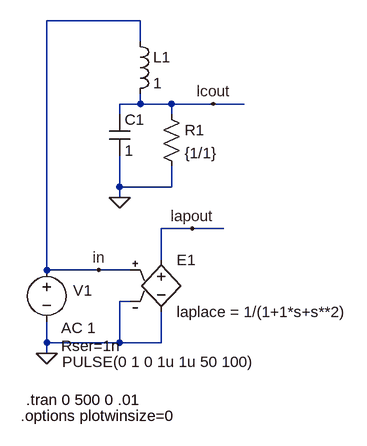
[diagram p0: schematic compare laplace and lpf q=1.asc]
compare laplace and lpf q=1.asc, the LTspice schematic file:
Version 4
SHEET 1 880 680
WIRE 224 -240 80 -240
WIRE 224 -208 224 -240
WIRE 224 -112 224 -128
WIRE 224 -112 192 -112
WIRE 272 -112 224 -112
WIRE 336 -112 272 -112
WIRE 384 -112 336 -112
WIRE 192 -96 192 -112
WIRE 272 -96 272 -112
WIRE 192 16 192 -32
WIRE 272 16 272 -16
WIRE 272 16 192 16
WIRE 192 32 192 16
WIRE 304 80 256 80
WIRE 352 80 304 80
WIRE 256 128 256 80
WIRE 80 144 80 -240
WIRE 160 144 80 144
WIRE 208 144 160 144
WIRE 208 192 192 192
WIRE 80 256 80 224
WIRE 192 256 192 192
WIRE 192 256 80 256
WIRE 256 256 256 208
WIRE 256 256 192 256
WIRE 80 272 80 256
FLAG 80 272 0
FLAG 304 80 lapout
FLAG 160 144 in
FLAG 192 32 0
FLAG 336 -112 lcout
SYMBOL e 256 112 R0
SYMATTR InstName E1
SYMATTR Value laplace = 1/(1+1*s+s**2)
SYMBOL voltage 80 128 R0
WINDOW 0 41 47 Left 2
WINDOW 3 24 157 Left 2
WINDOW 123 22 105 Left 2
WINDOW 39 22 133 Left 2
SYMATTR InstName V1
SYMATTR Value PULSE(0 1 0 1u 1u 50 100)
SYMATTR Value2 AC 1
SYMATTR SpiceLine Rser=1n
SYMBOL ind 208 -224 R0
SYMATTR InstName L1
SYMATTR Value 1
SYMATTR SpiceLine Rser=1n
SYMBOL cap 176 -96 R0
SYMATTR InstName C1
SYMATTR Value 1
SYMATTR SpiceLine Rser=1n
SYMBOL res 256 -112 R0
SYMATTR InstName R1
SYMATTR Value {1/1}
TEXT 48 344 Left 2 !.tran 0 500 0 .01
TEXT 40 368 Left 2 !.options plotwinsize=0

The netlist it stands for:
* compare laplace and lpf q=1.asc
E1 lapout 0 in 0 laplace = 1/(1+1*s+s**2)
V1 in 0 PULSE(0 1 0 1u 1u 50 100) AC 1 Rser=1n
L1 in lcout 1 Rser=1n
C1 lcout 0 1 Rser=1n
R1 lcout 0 {1/1}
.tran 0 500 0 .01
.options plotwinsize=0
.backanno
.end